# Altium project LSS_Gripper_Bottom_Board.PrjPcb (part 1 of 3)
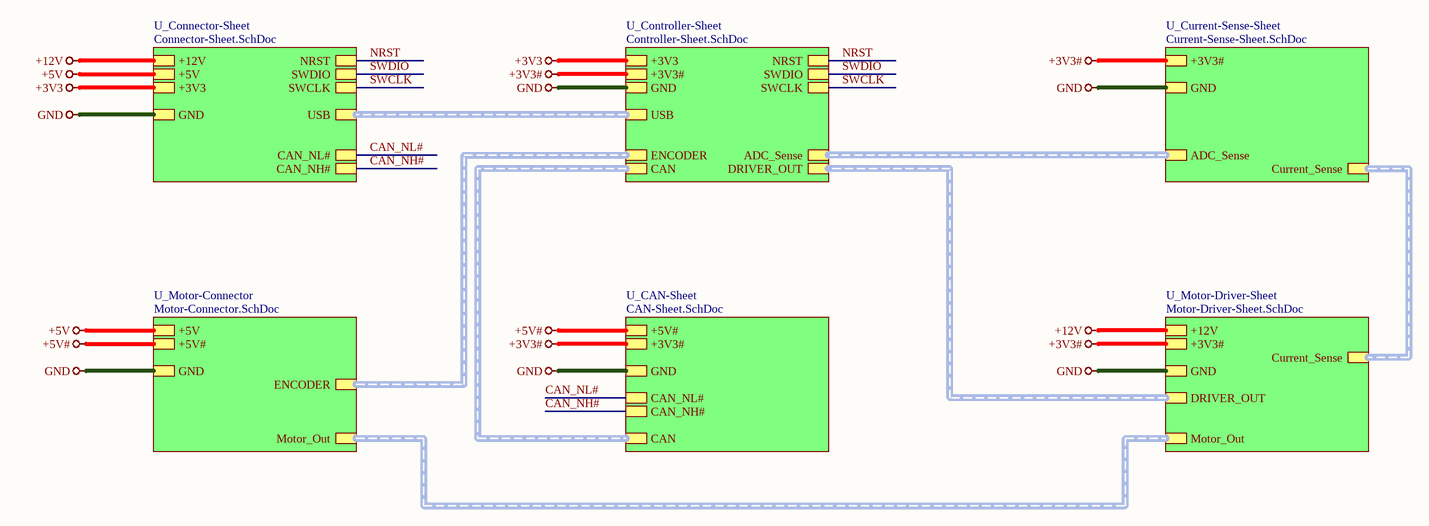
[diagram p0: Top-Sheet.SchDoc]
7 sheets, 142 parts. Net scope: hierarchical (ports join the sheet entries above them; power ports are global).
Board files: PCB1.PcbDoc, GripperBottomBoard.PcbDoc
Sheets:
  Top-Sheet.SchDoc
    U_CAN-Sheet = CAN-Sheet.SchDoc
    U_Connector-Sheet = Connector-Sheet.SchDoc
    U_Controller-Sheet = Controller-Sheet.SchDoc
    U_Current-Sense-Sheet = Current-Sense-Sheet.SchDoc
    U_Motor-Connector = Motor-Connector.SchDoc
    U_Motor-Driver-Sheet = Motor-Driver-Sheet.SchDoc

## Sheet Top-Sheet.SchDoc
size 420 x 297 mm; SheetNumber: 1; SheetTotal: 7

### Sub-sheets
U_CAN-Sheet = CAN-Sheet.SchDoc: CAN (harness CAN), +3V3#, GND, +5V#, CAN_NL#, CAN_NH#
U_Connector-Sheet = Connector-Sheet.SchDoc: USB (harness USB), +12V, +5V, +3V3, GND, CAN_NL#, CAN_NH#, SWCLK, SWDIO, NRST
U_Controller-Sheet = Controller-Sheet.SchDoc: ADC_Sense (harness ADC_Sense), ENCODER (harness ENCODER), USB (harness USB), +3V3, GND, DRIVER_OUT (harness DRIVER_OUT), CAN (harness CAN), SWCLK, SWDIO, NRST, +3V3#
U_Current-Sense-Sheet = Current-Sense-Sheet.SchDoc: Current_Sense (harness Current_Sense), ADC_Sense (harness ADC_Sense), GND, +3V3#
U_Motor-Connector = Motor-Connector.SchDoc: Motor_Out (harness Motor_Out), +5V, GND, ENCODER (harness ENCODER), +5V#
U_Motor-Driver-Sheet = Motor-Driver-Sheet.SchDoc: Current_Sense (harness Current_Sense), Motor_Out (harness Motor_Out), DRIVER_OUT (harness DRIVER_OUT), +12V, GND, +3V3#

### Nets
+3V3: sheet U_Connector-Sheet/+3V3, sheet U_Controller-Sheet/+3V3
+3V3#: sheet U_CAN-Sheet/+3V3#, sheet U_Controller-Sheet/+3V3#, sheet U_Current-Sense-Sheet/+3V3#, sheet U_Motor-Driver-Sheet/+3V3#
+5V: sheet U_Connector-Sheet/+5V, sheet U_Motor-Connector/+5V
+5V#: sheet U_CAN-Sheet/+5V#, sheet U_Motor-Connector/+5V#
+12V: sheet U_Connector-Sheet/+12V, sheet U_Motor-Driver-Sheet/+12V
GND: sheet U_CAN-Sheet/GND, sheet U_Connector-Sheet/GND, sheet U_Controller-Sheet/GND, sheet U_Current-Sense-Sheet/GND, sheet U_Motor-Connector/GND, sheet U_Motor-Driver-Sheet/GND
CAN_NH#: sheet U_CAN-Sheet/CAN_NH#, sheet U_Connector-Sheet/CAN_NH#
CAN_NL#: sheet U_CAN-Sheet/CAN_NL#, sheet U_Connector-Sheet/CAN_NL#
NRST: sheet U_Connector-Sheet/NRST, sheet U_Controller-Sheet/NRST
SWCLK: sheet U_Connector-Sheet/SWCLK, sheet U_Controller-Sheet/SWCLK
SWDIO: sheet U_Connector-Sheet/SWDIO, sheet U_Controller-Sheet/SWDIO

### Buses and harness runs
harness sheet U_CAN-Sheet/CAN = sheet U_Controller-Sheet/CAN
harness sheet U_Connector-Sheet/USB = sheet U_Controller-Sheet/USB
harness sheet U_Controller-Sheet/ADC_Sense = sheet U_Current-Sense-Sheet/ADC_Sense
harness sheet U_Controller-Sheet/DRIVER_OUT = sheet U_Motor-Driver-Sheet/DRIVER_OUT
harness sheet U_Controller-Sheet/ENCODER = sheet U_Motor-Connector/ENCODER
harness sheet U_Current-Sense-Sheet/Current_Sense = sheet U_Motor-Driver-Sheet/Current_Sense
harness sheet U_Motor-Connector/Motor_Out = sheet U_Motor-Driver-Sheet/Motor_Out

### Notes on the sheet
- File:
- Title:
- Date:
- Page
- Num:
- Total:
- Drawn By: Huzaifa Ali

## Sheet CAN-Sheet.SchDoc
size 420 x 297 mm; SheetNumber: 6; SheetTotal: 7
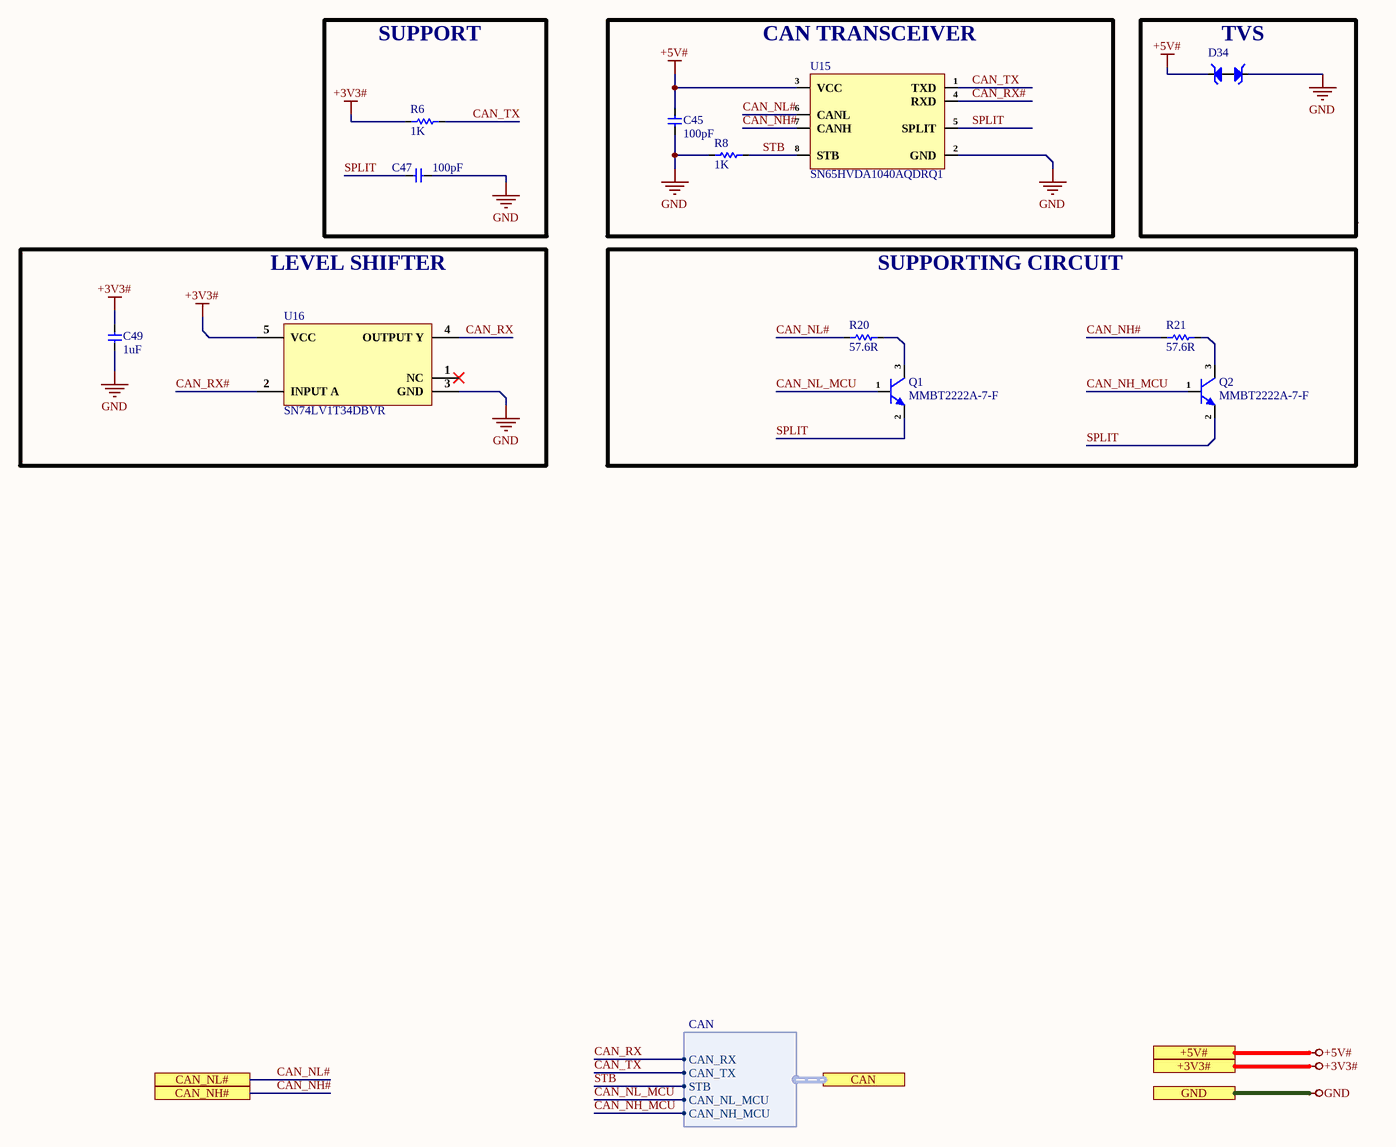
[diagram p1: CAN-Sheet.SchDoc]

### Parts
C45  100pF  [Cap-0402]
C47  100pF  [Cap-0402]
C49  1uF  [Cap-0603]
D34  PESD5V0H1BSFYL  [DSN0603-2]  (value not drawn)
Q1  MMBT2222A-7-F  [SOT-23]
Q2  MMBT2222A-7-F  [SOT-23]
R6  1K  [Res-0402]
R8  1K  [Res-0402]
R20  57.6R  [Res-0402]
R21  57.6R  [Res-0402]
U15  SN65HVDA1040AQDRQ1  [SOIC-8(0.154", 3.90mm Width)]
U16  SN74LV1T34DBVR  [SOT-23-5]

### Blocks framed on the sheet
SUPPORT: C47 R6
CAN TRANSCEIVER: C45 R8 U15
TVS: D34
LEVEL SHIFTER: C49 U16
SUPPORTING CIRCUIT: Q1 Q2 R20 R21

### Ports
+3V3# (see Top-Sheet[3B], Controller-Sheet[5D], Current-Sense-Sheet[5D]), +5V# (see Top-Sheet[3B], Motor-Connector[5D]), CAN (harness CAN, see Top-Sheet[3B], Controller-Sheet[4D]), CAN_NH# (see Top-Sheet[3B], Connector-Sheet[2D]), CAN_NL# (see Top-Sheet[3B], Connector-Sheet[2D]), GND (see Top-Sheet[3B], Connector-Sheet[5D], Controller-Sheet[5D], Current-Sense-Sheet[5D], Motor-Connector[5D], Motor-Driver-Sheet[5D])

### Harnesses
CAN: CAN_RX, CAN_TX, STB, CAN_NL_MCU, CAN_NH_MCU

### Nets
+3V3#: C49.2 R6.1 U16.5(VCC) ; port +3V3#
+5V#: C45.1 D34.2 U15.3(VCC) ; port +5V#
GND: C45.2 C47.1 C49.1 D34.1 R8.1 U15.2(GND) U16.3(GND) ; port GND
CAN_NH#: R21.1 U15.7(CANH) ; port CAN_NH#
CAN_NH_MCU: Q2.1(B) ; port CAN.CAN_NH_MCU
CAN_NL#: R20.1 U15.6(CANL) ; port CAN_NL#
CAN_NL_MCU: Q1.1(B) ; port CAN.CAN_NL_MCU
CAN_RX: U16.4(OUTPUT_Y) ; port CAN.CAN_RX
CAN_RX#: U15.4(RXD) U16.2(INPUT_A)
CAN_TX: R6.2 U15.1(TXD) ; port CAN.CAN_TX
SPLIT: C47.2 Q1.2(E) Q2.2(E) U15.5(SPLIT)
STB: R8.2 U15.8(STB) ; port CAN.STB
NetQ1_3: Q1.3(C) R20.2
NetQ2_3: Q2.3(C) R21.2

Not connected (* = marked no-connect by the designer): U16 1(NC)*

### Notes on the sheet
- File:
- Title:
- Date:
- Page
- Num:
- Total:
- Drawn By: Huzaifa Ali

### Library data of the parts
C45 C47 = CC0402JRNPO9BN101: CAP CER 100PF 50V C0G/NPO 0402; Manufacturer: Yageo; Dielectric Material: Ceramic; Tolerance: 5%; Dielectric: C0G; Temperature Coefficient: 30ppm/°C; Insulation Resistance: 100GR; Item Type: Capacitor; Supplier: Future Electronics; Supplier Part Number: 8934564; Manufacturer Part Number: CC0402JRNPO9BN101; RoHS: Yes; Category: Ceramic Capacitors; Stock: 11720000; Pricing: 10000=0.002, 40000=0.0019, 150000=0.0018, 400000=0.0018, 1000000=0.0017 (USD); Mounting Technology: Surface Mount; Case/Package: 0402; Pins: 2; Case Code (Imperial): 0402; Case Code (Metric): 1005; Min Operating Temperature: -55°C; Max Operating Temperature: 125°C; Value: 100pF; Voltage Rating: 50V; Voltage Rating (DC): 50V; Packaging: Tape and Reel; Package Quantity: 1; Termination: SMD/SMT; Voltage: 50V; Series: CC; Length: 1mm; Width: 0.02inch; Height: 0.5mm; Thickness: 0.022inch; Depth: 0.5mm; Radiation Hardening: No; RoHS Compliant: Yes; Reach SVHC Compliant: No; Lead Free: Lead Free; ComponentLink1URL: https://datasheet.ciiva.com/11786/0900766b80d84fbf-11786101.pdf?src-supplier=Rs; ComponentLink1Description: https://datasheet.ciiva.com/11786/0900766b80d84fbf-11786101.pdf?src-supplier=Rs; ComponentLink2URL: https://datasheet.ciiva.com/23767/25787-23767888.pdf?src-supplier=Newark; ComponentLink2Description: https://datasheet.ciiva.com/23767/25787-23767888.pdf?src-supplier=Newark; ComponentLink3URL: https://datasheet.ciiva.com/28450/1443161-28450220.pdf?src-supplier=Element14; ComponentLink3Description: https://datasheet.ciiva.com/28450/1443161-28450220.pdf?src-supplier=Element14; ComponentLink4URL: https://datasheet.ciiva.com/8033/1443161-8033598.pdf?src-supplier=Element14; ComponentLink4Description: https://datasheet.ciiva.com/8033/1443161-8033598.pdf?src-supplier=Element14; ComponentLink5URL: https://datasheet.ciiva.com/143/mlccorderingcode-143990.pdf?src-supplier=Digi-Key; ComponentLink5Description: https://datasheet.ciiva.com/143/mlccorderingcode-143990.pdf?src-supplier=Digi-Key; ComponentLink6URL: https://datasheet.ciiva.com/143/mlccorderingcode-143989.pdf?src-supplier=Digi-Key; ComponentLink6Description: https://datasheet.ciiva.com/143/mlccorderingcode-143989.pdf?src-supplier=Digi-Key; ComponentLink7URL: https://datasheet.ciiva.com/143/mlccorderingcode-143991.pdf?src-supplier=Digi-Key; ComponentLink7Description: https://datasheet.ciiva.com/143/mlccorderingcode-143991.pdf?src-supplier=Digi-Key; LCSC Part Number: C106200
C49 = CC0603KRX5R8BB105: CAP CER 1UF 25V X5R 0603; Manufacturer: Yageo; Tolerance: 10%; Item Type: Capacitor; Supplier 1: Digi-Key; Manufacturer Part Number: CC0603KRX5R8BB105; RoHS: Yes; Category: Ceramic Capacitors; Stock 1: 919939; Pricing 1: 1=0.12000, 10=0.08400, 50=0.04760, 100=0.03940, 500=0.02764, 1000=0.02288 (USD); Mount: Surface Mount; Case/Package: 0603; Number of Pins: 2; Case Code (Metric): 1608; Case Code (Imperial): 0603; Min Operating Temperature: -55°C; Max Operating Temperature: 85°C; Capacitance: 1uF; Dielectric: X5R; Package Quantity: 1; Voltage Rating: 25V; Packaging: Tape and Reel; Termination: SMD/SMT; Voltage Rating (DC): 25V; Series: CC; Construction: Flat; Length: 1.6mm; Width: 0.031inch; Height: 0.8mm; Thickness: 0.035inch; Depth: 0.8mm; Radiation Hardening: No; REACH SVHC: No SVHC; Lead Free: Lead Free; Halogen Free: Halogen Free; RoHS Compliant: Yes; ComponentLink1URL: https://datasheet.ciiva.com/176/mlccorderingcode-176785.pdf?src-supplier=Digi-Key; ComponentLink1Description: https://datasheet.ciiva.com/176/mlccorderingcode-176785.pdf?src-supplier=Digi-Key; ComponentLink2URL: https://datasheet.ciiva.com/176/mlccorderingcode-176786.pdf?src-supplier=Digi-Key; ComponentLink2Description: https://datasheet.ciiva.com/176/mlccorderingcode-176786.pdf?src-supplier=Digi-Key; ComponentLink3URL: https://datasheet.ciiva.com/176/mlccorderingcode-176787.pdf?src-supplier=Digi-Key; ComponentLink3Description: https://datasheet.ciiva.com/176/mlccorderingcode-176787.pdf?src-supplier=Digi-Key; ComponentLink4URL: https://datasheet.ciiva.com/17436/upy-gphc-x5r-4v-to-50v-12-17436952.pdf?src-supplier=Avnet+Europe; ComponentLink4Description: https://datasheet.ciiva.com/17436/upy-gphc-x5r-4v-to-50v-12-17436952.pdf?src-supplier=Avnet+Europe; ComponentLink5URL: https://datasheet.ciiva.com/7978/1525783-7978171.pdf?src-supplier=Element14; ComponentLink5Description: https://datasheet.ciiva.com/7978/1525783-7978171.pdf?src-supplier=Element14; ComponentLink6URL: https://datasheet.ciiva.com/11586/upy-gphc-x5r-4v-to-50v-12-11586318.pdf?src-supplier=Avnet; ComponentLink6Description: https://datasheet.ciiva.com/11586/upy-gphc-x5r-4v-to-50v-12-11586318.pdf?src-supplier=Avnet; Supplier Part Number 1: 311-1445-1-ND; LCSC Part Number: C14664
D34 = PESD5V0H1BSFYL: TVS DIODE 5VWM 6.3VC DSN0603-2; Manufacturer: Nexperia; Supplier 1: Avnet; Manufacturer Part Number: PESD5V0H1BSFYL; RoHS: Yes; Category: ESD and Circuit Protection ICs; Stock 1: 9000; Pricing 1: 18000=0.06453, 36000=0.06278, 54000=0.06104, 90000=0.05930, 180000=0.05755, 900000=0.05581, 1800000=0.05406 (USD); RoHS Compliant: Yes; ComponentLink1URL: http://www.farnell.com/datasheets/1961312.pdf?src-supplier=Farnell; ComponentLink1Description: http://www.farnell.com/datasheets/1961312.pdf?src-supplier=Farnell; ComponentLink2URL: https://assets.nexperia.com/documents/data-sheet/PESD5V0H1BSF.pdf?src-supplier=Digi-Key; ComponentLink2Description: https://assets.nexperia.com/documents/data-sheet/PESD5V0H1BSF.pdf?src-supplier=Digi-Key; ComponentLink3URL: http://www.farnell.com/datasheets/1961312.pdf?src-supplier=Newark; ComponentLink3Description: http://www.farnell.com/datasheets/1961312.pdf?src-supplier=Newark; Supplier Part Number 1: PESD5V0H1BSFYL; LCSC Part Number: C477989; Item Type: Diode
Q1 Q2 = MMBT2222A-7-F: TRANS NPN 40V 0.6A SMD SOT23-3; Manufacturer: Diodes; Max Power Dissipation: 300mW; Collector Base Voltage (VCBO): 75V; Max Collector Current: 600mA; hFE Min: 100; Frequency: 300MHz; Number of Elements: 1; Emitter Base Voltage (VEBO): 6V; Collector Emitter Saturation Voltage: 1V; Power Dissipation: 350mW; Element Configuration: Single; Current: 1A; Item Type: Mosfet; Supplier 1: Digi-Key; Manufacturer Part Number: MMBT2222A-7-F; Stock 1: 2471182; Pricing 1: 1=0.15, 10=0.134, 100=0.0729, 500=0.04486, 1000=0.03059 (USD); Mount: Surface Mount; Case/Package: SOT-23; Number of Pins: 3; Weight: 0.000282oz; Contact Plating: Matte,Tin; Min Operating Temperature: -55°C; Max Operating Temperature: 150°C; Packaging: Tape and Reel; Collector Emitter Voltage (VCEO): 40V; Polarity: NPN; Voltage Rating (DC): 40V; Package Quantity: 3000; Continuous Collector Current: 600mA; Collector Emitter Breakdown Voltage: 40V; Transition Frequency: 300MHz; Max Breakdown Voltage: 40V; Max Frequency: 300MHz; Termination: SMD/SMT; Gain Bandwidth Product: 300MHz; Current Rating: 600mA; Voltage: 40V; Length: 3.05mm; Height: 1mm; Width: 1.4mm; Radiation Hardening: No; Lead Free: Lead Free; REACH SVHC: No SVHC; ComponentLink1URL: http://www.diodes.com/datasheets/ds30041.pdf?src-supplier=Future+Electronics; ComponentLink1Description: http://www.diodes.com/datasheets/ds30041.pdf?src-supplier=Future+Electronics; ComponentLink2URL: http://www.diodes.com/datasheets/ds30041.pdf?src-supplier=Avnet; ComponentLink2Description: http://www.diodes.com/datasheets/ds30041.pdf?src-supplier=Avnet; ComponentLink3URL: https://www.verical.com/server-webapp/html/getDatasheet?partID=82692&src-supplier=Verical; ComponentLink3Description: https://www.verical.com/server-webapp/html/getDatasheet?partID=82692&src-supplier=Verical; ComponentLink4URL: https://www.diodes.com/assets/Datasheets/ds30041.pdf?src-supplier=Digi-Key; ComponentLink4Description: https://www.diodes.com/assets/Datasheets/ds30041.pdf?src-supplier=Digi-Key; ComponentLink5URL: http://www.diodes.com/datasheets/ds30041.pdf?src-supplier=Avnet+Europe; ComponentLink5Description: http://www.diodes.com/datasheets/ds30041.pdf?src-supplier=Avnet+Europe; ComponentLink6URL: http://www.diodes.com/datasheets/ds30041.pdf?src-supplier=Element14; ComponentLink6Description: http://www.diodes.com/datasheets/ds30041.pdf?src-supplier=Element14; Supplier Part Number 1: MMBT2222A-FDIDKR-ND; LCSC Part Number: C94515
R6 = RC0402FR-071KL: RES 1K OHM 1% 1/16W 0402; Manufacturer: Yageo; Resistance: 1kR; Temperature Coefficient: 100ppm/°C; Voltage Rating (DC): 50V; Power Rating: 62.5mW; Max Power Dissipation: 63mW; Item Type: Resistor; Supplier 1: Avnet; Manufacturer Part Number: RC0402FR-071KL; RoHS: Yes; Category: Chip SMD Resistors; Stock 1: 13030000; Pricing 1: 10000=0.00085, 20000=0.00087, 40000=0.00084, 60000=0.00083, 80000=0.00079, 100000=0.00078, 1000000=0.00076 (USD); Case/Package: 0402; Number of Pins: 2; Case Code (Imperial): 0402; Case Code (Metric): 1005; Size Code: 0402; Min Operating Temperature: -55°C; Max Operating Temperature: 155°C; Resistor Type: Thick Film; Tolerance: 1%; Packaging: Tape and Reel; Voltage Rating: 50V; Termination: SMD/SMT; Features: Moisture Resistant; Series: RC; Number of Terminations: 2; Resistance Tolerance: 1%; Construction: Rectangular; Technology: THICK FILM; Length: 1mm; Width: 0.5mm; Height: 0.32mm; Depth: 0.5mm; Reach SVHC Compliant: Yes; Lead Free: Lead Free; RoHS Compliant: Yes; Military Standard: Not; ComponentLink1URL: https://datasheet.ciiva.com/11819/0900766b80c66297-11819477.pdf?src-supplier=RSComponents; ComponentLink1Description: https://datasheet.ciiva.com/11819/0900766b80c66297-11819477.pdf?src-supplier=RSComponents; ComponentLink2URL: https://datasheet.ciiva.com/7983/1018594-7983502.pdf?src-supplier=Element14; ComponentLink2Description: https://datasheet.ciiva.com/7983/1018594-7983502.pdf?src-supplier=Element14; ComponentLink3URL: https://datasheet.ciiva.com/22747/1018594-22747513.pdf?src-supplier=Element14; ComponentLink3Description: https://datasheet.ciiva.com/22747/1018594-22747513.pdf?src-supplier=Element14; ComponentLink4URL: https://datasheet.ciiva.com/12666/pyu-rc0402-51-rohs-l-6-r-12666741.pdf?src-supplier=Mouser; ComponentLink4Description: https://datasheet.ciiva.com/12666/pyu-rc0402-51-rohs-l-6-r-12666741.pdf?src-supplier=Mouser; ComponentLink5URL: https://datasheet.ciiva.com/7849/1018594-7849869.pdf?src-supplier=Element14; ComponentLink5Description: https://datasheet.ciiva.com/7849/1018594-7849869.pdf?src-supplier=Element14; ComponentLink6URL: https://datasheet.ciiva.com/7849/1018594-7849871.pdf?src-supplier=Element14; ComponentLink6Description: https://datasheet.ciiva.com/7849/1018594-7849871.pdf?src-supplier=Element14; ComponentLink7URL: https://datasheet.ciiva.com/17063/pyu-rc0402-51-rohs-l-6-r-17063193.pdf?src-supplier=Future+Electronics; ComponentLink7Description: https://datasheet.ciiva.com/17063/pyu-rc0402-51-rohs-l-6-r-17063193.pdf?src-supplier=Future+Electronics; Supplier Part Number 1: RC0402FR-071KL; LCSC Part Number: C106235
R8 = CRCW04021K00FKEDHP: RES SMD 1K OHM 1% 1/5W 0402; Manufacturer: Vishay Dale; Resistance: 1kR; Temperature Coefficient: 100ppm/°C; Power Rating: 125mW; Voltage Rating: 50V; Supplier 1: Digi-Key; Manufacturer Part Number: CRCW04021K00FKEDHP; Stock 1: 315989; Pricing 1: 1=0.15, 10=0.132, 100=0.0506, 1000=0.02226, 2500=0.01923, 5000=0.0172 (USD); Mount: Surface Mount; Case/Package: 0402; Number of Pins: 2; Contact Plating: Tin; Weight: 2.3E-05oz; Case Code (Imperial): 0402; Case Code (Metric): 1005; Size Code: 0402; Min Operating Temperature: -55°C; Max Operating Temperature: 155°C; Tolerance: 1%; Resistor Type: Thick Film; Package Quantity: 10; Packaging: Tape and Reel; Number of Terminations: 2; Termination: SMD/SMT; Max Power Dissipation: 125mW; Voltage Rating (DC): 50V; Features: Automotive AEC-Q200; Series: CRCW-HP; Construction: Rectangular; Technology: THICK FILM; Resistance Tolerance: 1%; Length: 1mm; Width: 0.5mm; Height: 0.3mm; Depth: 0.5mm; Radiation Hardening: No; REACH SVHC: Unknown; Military Standard: Not; Lead Free: Lead Free; RoHS Compliant: Yes; ComponentLink1URL: http://www.farnell.com/datasheets/2339608.pdf?src-supplier=Element14; ComponentLink1Description: http://www.farnell.com/datasheets/2339608.pdf?src-supplier=Element14; ComponentLink2URL: http://www.vishay.com/docs/20043/crcwhpe3.pdf?src-supplier=Digi-Key; ComponentLink2Description: http://www.vishay.com/docs/20043/crcwhpe3.pdf?src-supplier=Digi-Key; ComponentLink3URL: http://www.mouser.com/ds/2/427/crcwhpe3-46056.pdf?src-supplier=Mouser; ComponentLink3Description: http://www.mouser.com/ds/2/427/crcwhpe3-46056.pdf?src-supplier=Mouser; ComponentLink4URL: http://www.vishay.com/docs/20043/crcwhpe3.pdf?src-supplier=Avnet; ComponentLink4Description: http://www.vishay.com/docs/20043/crcwhpe3.pdf?src-supplier=Avnet; ComponentLink5URL: http://www.vishay.com/docs/20043/crcwhpe3.pdf?src-supplier=Future+Electronics; ComponentLink5Description: http://www.vishay.com/docs/20043/crcwhpe3.pdf?src-supplier=Future+Electronics; Supplier Part Number 1: 541-1.00KYCT-ND; LCSC Part Number: C313354
R20 R21 = ERJ-2RKF57R6X: RES SMD 57.6 OHM 1% 1/10W 0402; Manufacturer: Panasonic; Item Type: Resistors; Supplier: Mouser; Supplier Part Number: 667-ERJ-2RKF57R6X; Manufacturer Part Number: ERJ-2RKF57R6X; RoHS: Yes; Stock: 32931; Pricing: 1=0.1, 10=0.015, 50=0.015, 100=0.009, 1000=0.006, 10000=0.003 (USD); ComponentLink1URL: https://datasheet.ciiva.com/9188/aoa0000ce2-9188571.pdf?src-supplier=Avnet; ComponentLink1Description: https://datasheet.ciiva.com/9188/aoa0000ce2-9188571.pdf?src-supplier=Avnet; ComponentLink2URL: https://datasheet.ciiva.com/9188/aoa0000ce2-9188574.pdf?src-supplier=Avnet; ComponentLink2Description: https://datasheet.ciiva.com/9188/aoa0000ce2-9188574.pdf?src-supplier=Avnet; ComponentLink3URL: https://datasheet.ciiva.com/24026/aoa0000ce2-24026248.pdf?src-supplier=Mouser; ComponentLink3Description: https://datasheet.ciiva.com/24026/aoa0000ce2-24026248.pdf?src-supplier=Mouser; ComponentLink4URL: https://datasheet.ciiva.com/43467/1678782-43467198.pdf?src-supplier=Farnell; ComponentLink4Description: https://datasheet.ciiva.com/43467/1678782-43467198.pdf?src-supplier=Farnell; ComponentLink5URL: https://datasheet.ciiva.com/46372/1678782-46372935.pdf?src-supplier=Element14; ComponentLink5Description: https://datasheet.ciiva.com/46372/1678782-46372935.pdf?src-supplier=Element14; ComponentLink6URL: https://datasheet.ciiva.com/46372/1678782-46372936.pdf?src-supplier=Element14; ComponentLink6Description: https://datasheet.ciiva.com/46372/1678782-46372936.pdf?src-supplier=Element14; ComponentLink7URL: https://datasheet.ciiva.com/22668/1678782-22668391.pdf?src-supplier=Element14; ComponentLink7Description: https://datasheet.ciiva.com/22668/1678782-22668391.pdf?src-supplier=Element14; ComponentLink8URL: https://datasheet.ciiva.com/22743/1678782-22743894.pdf?src-supplier=Element14; ComponentLink8Description: https://datasheet.ciiva.com/22743/1678782-22743894.pdf?src-supplier=Element14; ComponentLink9URL: https://datasheet.ciiva.com/30107/aoa0000ce2-30107676.pdf?src-supplier=Onlinecomponents.com; ComponentLink9Description: https://datasheet.ciiva.com/30107/aoa0000ce2-30107676.pdf?src-supplier=Onlinecomponents.com; LCSC Part Number: C3025671
U15 = SN65HVDA1040AQDRQ1: IC TRANSCEIVER HALF 1/1 8SOIC; Manufacturer: Texas Instruments; Supplier: Mouser; LCSC Part Number: C188675; Manufacturer Part Number: SN65HVDA1040AQDRQ1; RoHS: Yes; Item Type: IC; Stock: 5009; Pricing: 1=2.2, 10=1.87, 50=1.87, 100=1.59, 1000=1.08, 10000=0.971 (USD); ComponentLink1URL: https://datasheet.ciiva.com/28652/1787993-28652354.pdf?src-supplier=Element14; ComponentLink1Description: https://datasheet.ciiva.com/28652/1787993-28652354.pdf?src-supplier=Element14; ComponentLink2URL: https://datasheet.ciiva.com/41461/001187135-da-01-en-ic-transcv-sn65hvda1040aqdrq1-soic-8-tid-41461891.pdf?src-supplier=Conrad; ComponentLink2Description: https://datasheet.ciiva.com/41461/001187135-da-01-en-ic-transcv-sn65hvda1040aqdrq1-soic-8-tid-41461891.pdf?src-supplier=Conrad; ComponentLink3URL: https://datasheet.ciiva.com/15150/getdatasheetpartid-184324-15150727.pdf?src-supplier=Verical; ComponentLink3Description: https://datasheet.ciiva.com/15150/getdatasheetpartid-184324-15150727.pdf?src-supplier=Verical; ComponentLink4URL: https://datasheet.ciiva.com/1766/sn65hvda1040a-q1-1766438.pdf?src-supplier=Digikey; ComponentLink4Description: https://datasheet.ciiva.com/1766/sn65hvda1040a-q1-1766438.pdf?src-supplier=Digikey; ComponentLink5URL: https://datasheet.ciiva.com/1766/sn65hvda1040a-q1-1766439.pdf?src-supplier=Digikey; ComponentLink5Description: https://datasheet.ciiva.com/1766/sn65hvda1040a-q1-1766439.pdf?src-supplier=Digikey; ComponentLink6URL: https://datasheet.ciiva.com/1766/sn65hvda1040a-q1-1766440.pdf?src-supplier=Digikey; ComponentLink6Description: https://datasheet.ciiva.com/1766/sn65hvda1040a-q1-1766440.pdf?src-supplier=Digikey
U16 = SN74LV1T34DBVR: IC BUF NON-INVERT 5.5V SOT23-5; Manufacturer: Texas Instruments; Number of Elements: 1; Logic Function: Buffer,Inverting; High Level Output Current: -8mA; Low Level Output Current: 8mA; Min Supply Voltage: 1.6V; Polarity: Non-Inverting; Propagation Delay: 15.5ns; Quiescent Current: 1uA; Supplier 1: Digi-Key; Manufacturer Part Number: SN74LV1T34DBVR; Stock 1: 37360; Pricing 1: 1=0.43, 10=0.349, 25=0.3192, 100=0.2374, 250=0.2152, 500=0.17808, 1000=0.13356 (USD); Mount: Surface Mount; Case/Package: SOT-23-5; Number of Pins: 5; Weight: 0.000353oz; Min Operating Temperature: -40°C; Max Operating Temperature: 125°C; Packaging: Tape and Reel; Number of Bits per Element: 1; Number of Bits: 1; Package Quantity: 3000; Max Supply Voltage: 5.5V; Number of Input Lines: 1; Number of Output Lines: 1; Operating Supply Current: 8mA; Number of Channels: 1; Number of Inputs: 1; Number of Outputs: 1; Radiation Hardening: No; RoHS Compliant: Yes; REACH SVHC: No SVHC; Lead Free: Lead Free; ComponentLink1URL: http://www.ti.com/lit/pdf/sdyu001?src-supplier=Digi-Key; ComponentLink1Description: http://www.ti.com/lit/pdf/sdyu001?src-supplier=Digi-Key; ComponentLink2URL: http://www.ti.com/lit/ds/symlink/sn74lv1t34.pdf?src-supplier=Avnet; ComponentLink2Description: http://www.ti.com/lit/ds/symlink/sn74lv1t34.pdf?src-supplier=Avnet; Supplier Part Number 1: 296-37176-6-ND; LCSC Part Number: C100024; Item Type: IC

## Sheet Connector-Sheet.SchDoc
size 420 x 297 mm; SheetNumber: 7; SheetTotal: 7
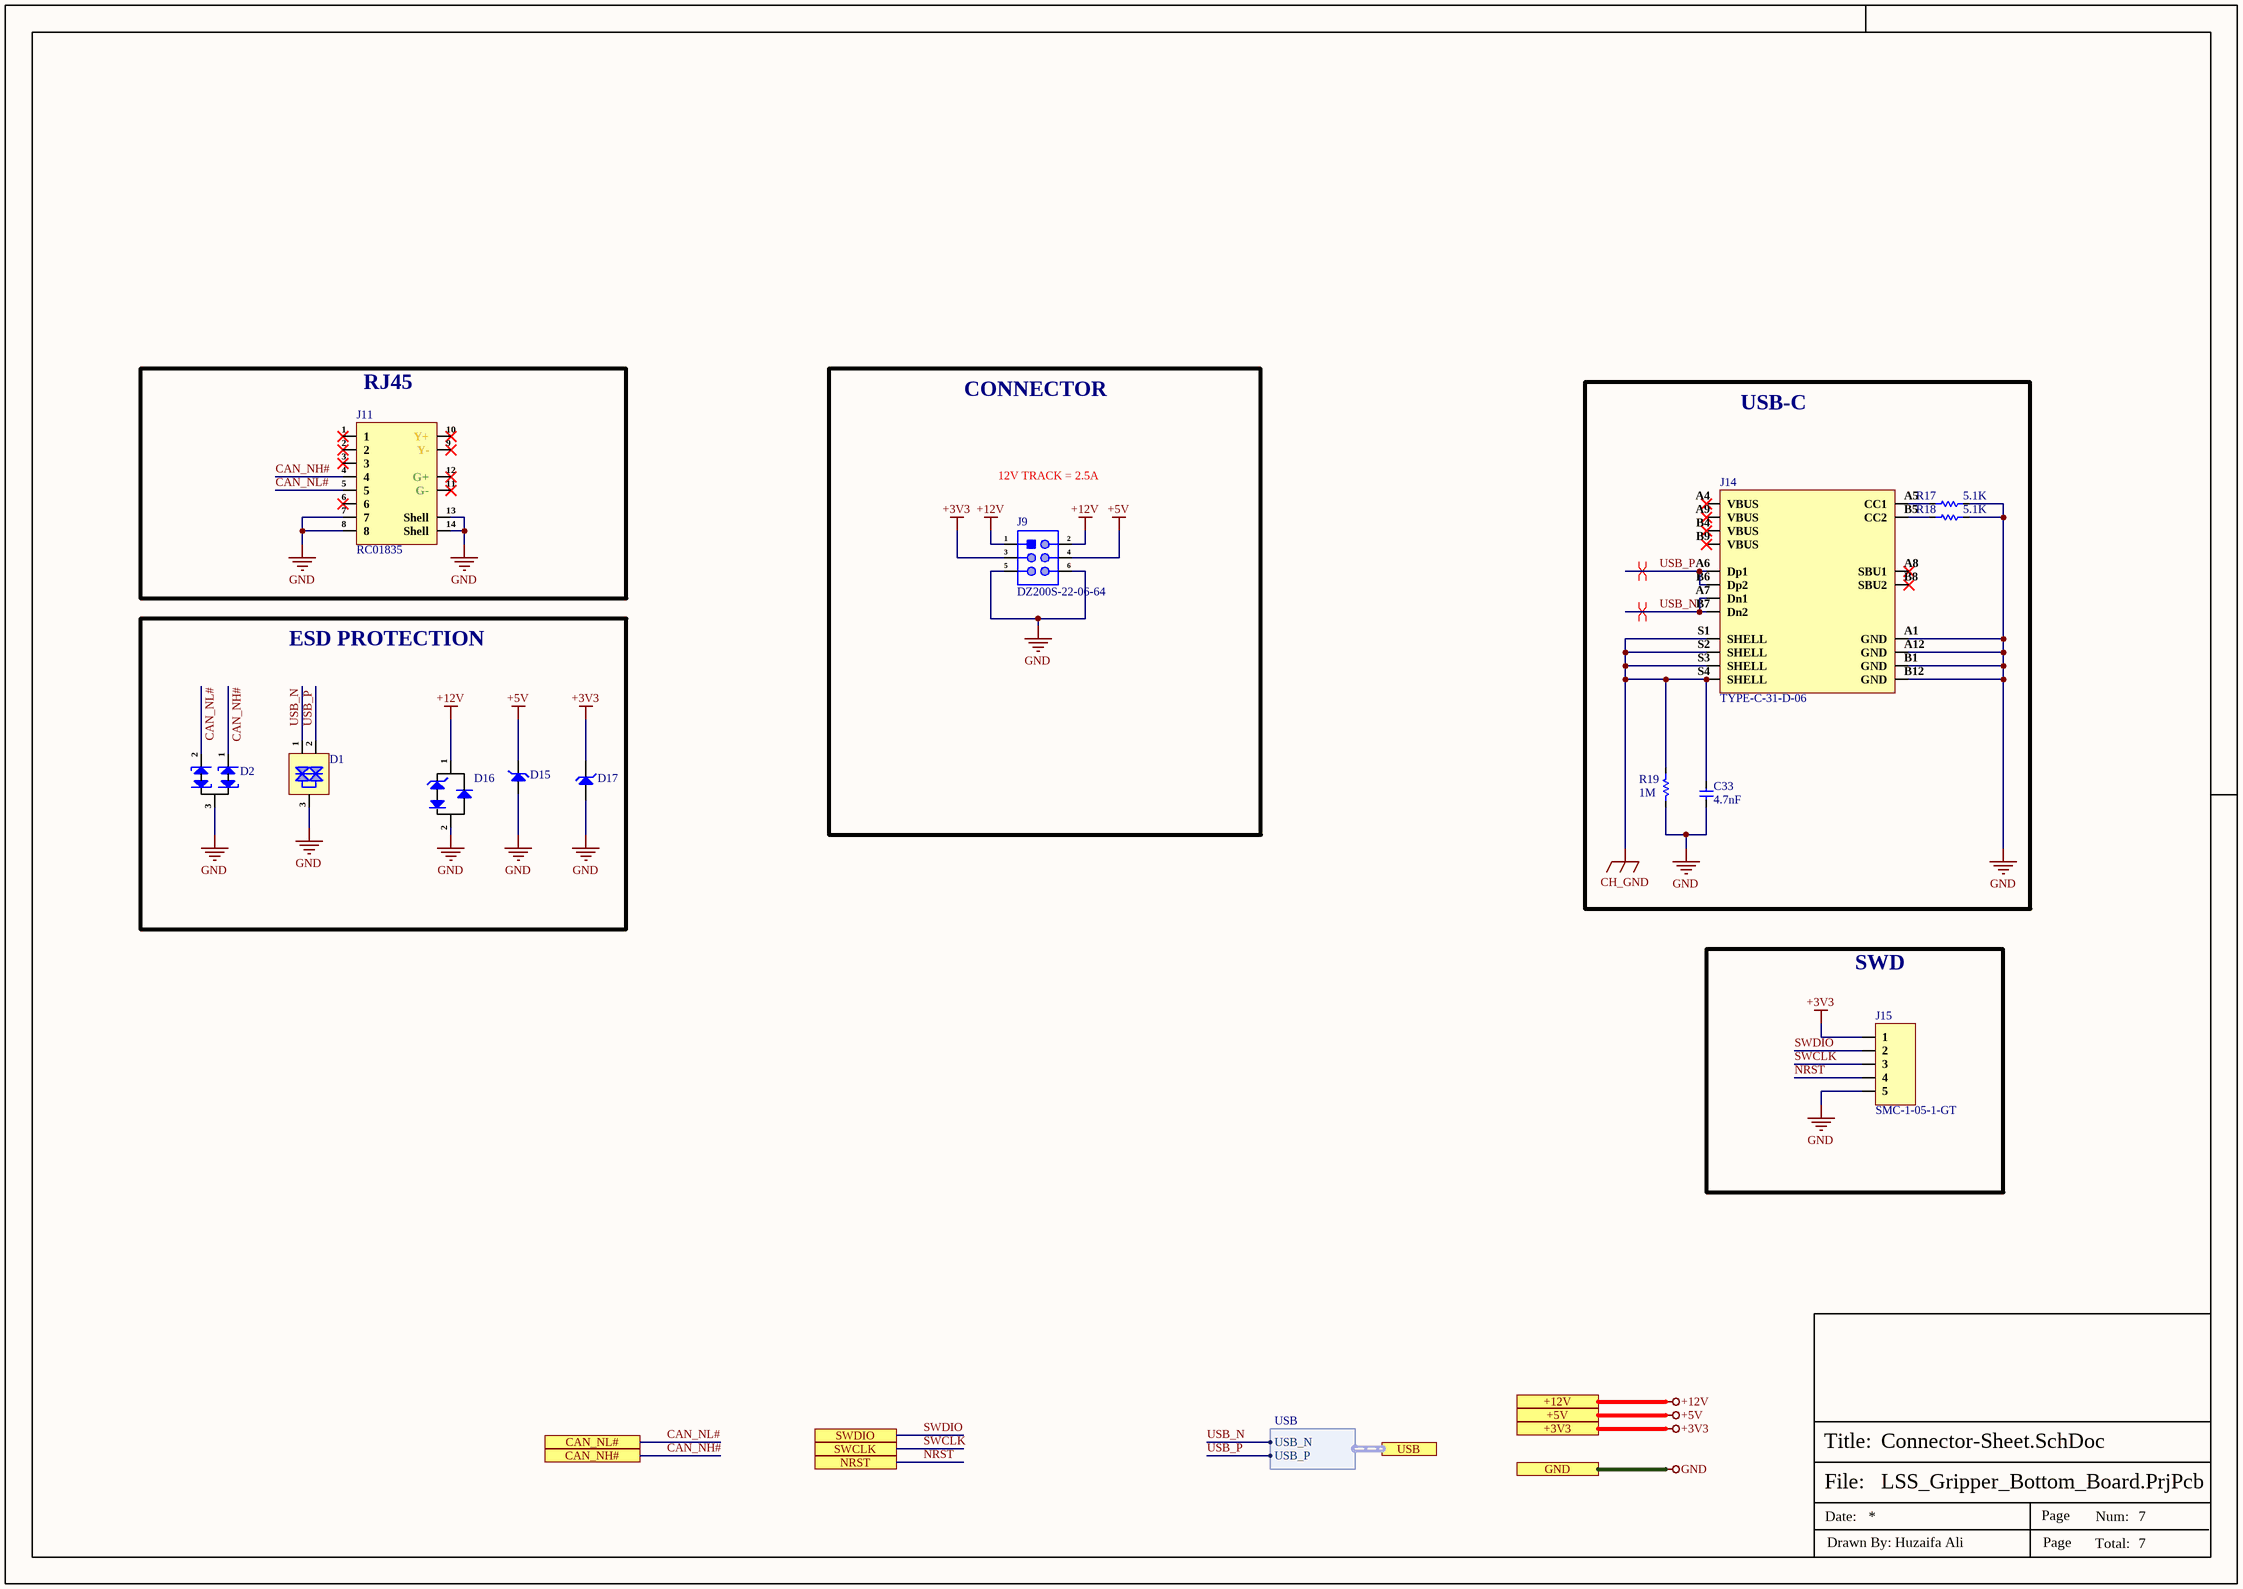
[diagram p2: Connector-Sheet.SchDoc]

### Parts
C33  4.7nF  [Cap-1206]
D1  ESD5302F-3/TR  [Sot-23]  (value not drawn)
D2  PESD2CAN,215  [SOT-23]  (value not drawn)
D15  P6SMB6.8A  [SMB_]  (value not drawn)
D16  SD12LC  [SOD-323]  (value not drawn)
D17  AZ3003-01G  [SOD-123]  (value not drawn)
J9  DZ200S-22-06-64  [HDR 2x3 Male SMD(2mm Pitch)]
J11  RC01835  [RC01835]
J14  TYPE-C-31-D-06  [TYPE-C-31-D-06]
J15  SMC-1-05-1-GT  [SMC-1-05-1-GT]
R17  5.1K  [Res-0402]
R18  5.1K  [Res-0402]
R19  1M  [Res-0603]

### Blocks framed on the sheet
RJ45: J11
CONNECTOR: J9
USB-C: C33 J14 R17-R19
ESD PROTECTION: D1 D2 D15-D17
SWD: J15

### Ports
+3V3 (see Top-Sheet[2B], CAN-Sheet[5D], Controller-Sheet[5D], Current-Sense-Sheet[5D], Motor-Driver-Sheet[5D]), +5V (see Top-Sheet[2A], CAN-Sheet[5D], Motor-Connector[5D]), +12V (see Top-Sheet[2A], Motor-Driver-Sheet[5D]), CAN_NH# (see Top-Sheet[2B], CAN-Sheet[2D]), CAN_NL# (see Top-Sheet[2B], CAN-Sheet[2D]), GND (see Top-Sheet[2B], CAN-Sheet[5D], Controller-Sheet[5D], Current-Sense-Sheet[5D], Motor-Connector[5D], Motor-Driver-Sheet[5D]), NRST (see Top-Sheet[2A], Controller-Sheet[5D]), SWCLK (see Top-Sheet[2B], Controller-Sheet[5D]), SWDIO (see Top-Sheet[2A], Controller-Sheet[5D]), USB (harness USB, see Top-Sheet[2B], Controller-Sheet[4D])

### Harnesses
USB: USB_N, USB_P

### Nets
+3V3: D17.2(K) J9.3 J15.1 ; port +3V3
+5V: D15.2(C) J9.4 ; port +5V
+12V: D16.1(K) J9.1 J9.2 ; port +12V
CH_GND: C33.1 J14.S1(SHELL) J14.S2(SHELL) J14.S3(SHELL) J14.S4(SHELL) R19.1
GND: C33.2 D1.3(GND) D2.3(C_K) D15.1(A) D16.2(A/K) D17.1(A) J9.5 J9.6 J11.7 J11.8 J11.13(Shell) J11.14(Shell) J14.A1(GND) J14.A12(GND) J14.B1(GND) J14.B12(GND) J15.5 R17.2 R18.2 R19.2 ; port GND
CAN_NH#: D2.1(K1) J11.4 ; port CAN_NH#
CAN_NL#: D2.2(K2) J11.5 ; port CAN_NL#
NRST: J15.4 ; port NRST
SWCLK: J15.3 ; port SWCLK
SWDIO: J15.2 ; port SWDIO
USB_N: D1.1(I/O1) J14.A7(Dn1) J14.B7(Dn2) ; port USB.USB_N
USB_P: D1.2(I/O2) J14.A6(Dp1) J14.B6(Dp2) ; port USB.USB_P
NetJ14_A5: J14.A5(CC1) R17.1
NetJ14_B5: J14.B5(CC2) R18.1

Not connected (* = marked no-connect by the designer): J11 1* 2* 3* 6* 9(Y-)* 10(Y+)* 11(G-)* 12(G+)*; J14 A4(VBUS)* A8(SBU1)* A9(VBUS)* B4(VBUS)* B8(SBU2)* B9(VBUS)*

### Layout directives
differential pair; net class USB; differential pair class USB_Lines; rule Impedance Constraint [Min = 88.00    Max = 90.00    ]; rule Matched Net Lengths [Tolerance = 20mil]: USB_N, USB_P

### Notes on the sheet
- 12V TRACK = 2.5A
- File:
- Title:
- Date:
- Page
- Num:
- Total:
- Drawn By: Huzaifa Ali

### Library data of the parts
C33 = CC1206KKX7RCBB472: CAP CER 4700PF 1KV X7R 1206; Manufacturer: Yageo; Dielectric Material: Ceramic; Tolerance: 10%; Item Type: Capacitor; Supplier 1: Future Electronics; Manufacturer Part Number: CC1206KKX7RCBB472; RoHS: Yes; Category: Ceramic Capacitors; Stock 1: 180000; Pricing 1: 3000=0.02860, 9000=0.02750, 15000=0.02700, 45000=0.02600, 75000=0.02510 (USD); Mount: Surface Mount; Case/Package: 1206; Number of Pins: 2; Case Code (Imperial): 1206; Case Code (Metric): 3216; Weight: 0.000571oz; Min Operating Temperature: -55°C; Max Operating Temperature: 125°C; Voltage Rating: 1kV; Capacitance: 4.7nF; Packaging: Tape and Reel; Voltage Rating (DC): 1kV; Dielectric: X7R; Termination: SMD/SMT; Resistor Type: Ceramic; Series: CC; Length: 3.2mm; Width: 0.063inch; Thickness: 0.057inch; Depth: 1.6mm; Radiation Hardening: No; Lead Free: Lead Free; RoHS Compliant: Yes; ComponentLink1URL: https://datasheet.ciiva.com/13208/upy-gp-np0-16v-to-50v-8-13208693.pdf?src-supplier=Mouser; ComponentLink1Description: https://datasheet.ciiva.com/13208/upy-gp-np0-16v-to-50v-8-13208693.pdf?src-supplier=Mouser; ComponentLink2URL: https://datasheet.ciiva.com/11466/hv-11466701.pdf?src-supplier=Avnet; ComponentLink2Description: https://datasheet.ciiva.com/11466/hv-11466701.pdf?src-supplier=Avnet; Supplier Part Number 1: 7130131; LCSC Part Number: C107198
D1 = ESD5302F-3/TR: 16A 20V 7V 5V@Max Unidirectional SOT-23 TVS ROHS; Manufacturer: WILLSEMI; Item Type: Diode; Manufacturer Part Number: ESD5302F-3/TR; Package: SOT-23; LCSC Part Number: C239643; ComponentLink1Description: LCSC; ComponentLink1URL: https://www.lcsc.com/product-detail/TVS_WILLSEMI-Will-Semicon-ESD5302F-3-TR_C239643.html
D2 = PESD2CAN,215: TVS DIODE 24VWM 41VC TO236AB; Manufacturer: Nexperia; Supplier 1: Arrow Electronics; Manufacturer Part Number: PESD2CAN,215; RoHS: No; Category: ESD and Circuit Protection ICs; Stock 1: 775; Pricing 1: 1=0.48690, 10=0.40120, 25=0.38650, 50=0.33780, 100=0.25440, 250=0.25380, 500=0.25120 (USD); ComponentLink1URL: http://www.farnell.com/datasheets/1750978.pdf?src-supplier=Farnell; ComponentLink1Description: http://www.farnell.com/datasheets/1750978.pdf?src-supplier=Farnell; ComponentLink2URL: https://assets.nexperia.com/documents/data-sheet/PESD2CAN.pdf?src-supplier=Digi-Key; ComponentLink2Description: https://assets.nexperia.com/documents/data-sheet/PESD2CAN.pdf?src-supplier=Digi-Key; ComponentLink3URL: http://www.farnell.com/datasheets/1750978.pdf?src-supplier=Newark; ComponentLink3Description: http://www.farnell.com/datasheets/1750978.pdf?src-supplier=Newark; Supplier Part Number 1: PESD2CAN,215; LCSC Part Number: C75176
D15 = P6SMB6.8A: 58.1A 600W 10.5V@58.1A 6.45V Unidirectional 5.8V SMB Electrostatic and Surge Protection (TVS/ESD) ROHS; Manufacturer: BORN; Manufacturer Part Number: P6SMB6.8A; Package: SMB; LCSC Part Number: C5439947; Item Type: TVS/ESD; ComponentLink1Description: LCSC; ComponentLink1URL: https://www.lcsc.com/product-detail/Electrostatic-and-Surge-Protection-TVS-ESD_BORN-P6SMB6-8A_C5439947.html
D16 = SD12LC: TVS DIODE 12VWM 28.6VC SOD323; Manufacturer: Sangdest Microelectronics; Supplier: DigiKey; Supplier Part Number: 1655-SD12LCCT-ND; Manufacturer Part Number: SD12LC; Stock: 575; Pricing: 1=0.43, 10=0.305, 100=0.1541, 500=0.13654, 1000=0.10625 (USD); Item Type: Diode
D17 = AZ3003-01G: TVS SURGE PROTECTOR 1-CH 3.3V; Manufacturer: Amazing; Item Type: Diode; Manufacturer Part Number: AZ3003-01G; Package: SOD-123; LCSC Part Number: -; ComponentLink1Description: Digikey; ComponentLink1URL: https://www.digikey.com/en/products/detail/amazing/AZ3003-01G/16615352?s=N4IgTCBcDaIIIC0DMAGFSC0KCMBxEAugL5A
J9 = DZ200S-22-06-64: Brick nogging Square Pins 6P 2mm 双排 2x3P SMD,P=2mm Pin Headers ROHS; Manufacturer: DEALON; Item Type: Connector; Manufacturer Part Number: DZ200S-22-06-64; LCSC Part Number: C5160768; Package: SMD,P=2mm; ComponentLink1Description: LCSC Link; ComponentLink1URL: https://www.lcsc.com/product-detail/Pin-Headers_DEALON-DZ200S-22-06-64_C5160768.html
J11 = RC01835: RJ45 RJReceptacle 1 有屏蔽 Sink board WithLED -40℃~+70℃ Plugin Ethernet Connectors/Modular Connectors (RJ45 RJ11) ROHS; Manufacturer: RCH; Manufacturer Part Number: RC01835; Package: Plugin; LCSC Part Number: C708648; Item Type: Ethernet; ComponentLink1Description: LCSC; ComponentLink1URL: https://www.lcsc.com/product-detail/Ethernet-Connectors-Modular-Connectors-RJ45-RJ11_RCH-RC01835_C708648.html
J14 = TYPE-C-31-D-06: 1 Brick nogging 16 Female -25℃~+85℃ Type-C SMD USB Connectors ROHS; Manufacturer: Korean Hroparts Elec; Manufacturer Part Number: TYPE-C-31-D-06; Package: Custom; LCSC Part Number: C2689964; Item Type: USB Connector; ComponentLink1Description: LCSC; ComponentLink1URL: https://www.lcsc.com/product-detail/USB-Connectors_Korean-Hroparts-Elec-TYPE-C-31-D-06_C2689964.html
J15 = SMC-1-05-1-GT: MACHINE PIN SOCKET 5P 2.54MM PIT; Manufacturer: Adam Equipment; Item Type: Pin Header; Supplier 1: Digi-Key; Manufacturer Part Number: SMC-1-05-1-GT; RoHS: No; Stock 1: 1697; Pricing 1: 1=0.41000, 10=0.38500, 25=0.33040, 50=0.28080, 100=0.26970, 250=0.24224, 500=0.23120, 1000=0.19268, 2500=0.17616 (USD); Supplier Part Number 1: 2057-SMC-1-05-1-GT-ND; LCSC Part Number: C3320109
R17 R18 = RC0402FR-075K1L: RES 5.1K OHM 1% 1/16W 0402; Manufacturer: Yageo; Power Rating: 63mW; Resistance: 5.1kR; Temperature Coefficient: 100ppm/°C; Voltage Rating: 50V; Item Type: Resistor; Supplier 1: Avnet; Manufacturer Part Number: RC0402FR-075K1L; RoHS: Yes; Category: Chip SMD Resistors; Stock 1: 65000; Pricing 1: 10000=0.00085 (USD); Case/Package: 0402; Case Code (Metric): 1005; Case Code (Imperial): 0402; Min Operating Temperature: -55°C; Max Operating Temperature: 155°C; Tolerance: 1%; Technology: THICK FILM; Packaging: Tape and Reel; Package Quantity: 1; Resistor Type: Thick Film; Number of Terminations: 2; Termination: SMD/SMT; Max Power Dissipation: 63mW; Voltage Rating (DC): 50V; Working Voltage: 50V; Features: Moisture Resistant; Series: RC; Resistance Tolerance: 1%; Construction: Rectangular; Length: 1mm; Width: 0.02inch; Height: 0.016inch; Depth: 0.5mm; RoHS Compliant: Yes; Military Standard: Not; Lead Free: Lead Free; ComponentLink1URL: https://datasheet.ciiva.com/7983/1018594-7983519.pdf?src-supplier=Element14; ComponentLink1Description: https://datasheet.ciiva.com/7983/1018594-7983519.pdf?src-supplier=Element14; ComponentLink2URL: https://datasheet.ciiva.com/46394/1018594-46394936.pdf?src-supplier=Element14; ComponentLink2Description: https://datasheet.ciiva.com/46394/1018594-46394936.pdf?src-supplier=Element14; ComponentLink3URL: https://datasheet.ciiva.com/2453/pyu-r-int-thick-7-2453401.pdf?src-supplier=Digi-Key; ComponentLink3Description: https://datasheet.ciiva.com/2453/pyu-r-int-thick-7-2453401.pdf?src-supplier=Digi-Key; ComponentLink4URL: https://datasheet.ciiva.com/2453/pyu-r-int-thick-7-2453402.pdf?src-supplier=Digi-Key; ComponentLink4Description: https://datasheet.ciiva.com/2453/pyu-r-int-thick-7-2453402.pdf?src-supplier=Digi-Key; ComponentLink5URL: https://datasheet.ciiva.com/2453/pyu-r-int-thick-7-2453400.pdf?src-supplier=Digi-Key; ComponentLink5Description: https://datasheet.ciiva.com/2453/pyu-r-int-thick-7-2453400.pdf?src-supplier=Digi-Key; ComponentLink6URL: https://datasheet.ciiva.com/12558/pyu-rc0402-51-rohs-l-6-r-8721-12558460.pdf?src-supplier=Mouser; ComponentLink6Description: https://datasheet.ciiva.com/12558/pyu-rc0402-51-rohs-l-6-r-8721-12558460.pdf?src-supplier=Mouser; ComponentLink7URL: https://datasheet.ciiva.com/16744/pyu-rc0402-51-rohs-l-6-r-16744283.pdf?src-supplier=Future+Electronics; ComponentLink7Description: https://datasheet.ciiva.com/16744/pyu-rc0402-51-rohs-l-6-r-16744283.pdf?src-supplier=Future+Electronics; ComponentLink8URL: https://datasheet.ciiva.com/15189/getdatasheetpartid-323636-15189493.pdf?src-supplier=Verical; ComponentLink8Description: https://datasheet.ciiva.com/15189/getdatasheetpartid-323636-15189493.pdf?src-supplier=Verical; Supplier Part Number 1: RC0402FR-075K1L; LCSC Part Number: C105872
R19 = RC0603FR-071ML: RES SMD 1M OHM 1% 1/10W 0603; Manufacturer: Yageo; Voltage Rating: 50V; Resistance: 1MR; Power Rating: 100mW; Temperature Coefficient: 100ppm/°C; Item Type: Resistor; Supplier 1: Digi-Key; Manufacturer Part Number: RC0603FR-071ML; Stock 1: 3824601; Pricing 1: 1=0.1, 10=0.023, 100=0.0094, 1000=0.00421, 2500=0.00366 (USD); Case/Package: 0603; Number of Pins: 2; Case Code (Imperial): 0603; Case Code (Metric): 1608; Min Operating Temperature: -55°C; Max Operating Temperature: 155°C; Voltage Rating (DC): 50V; Tolerance: 1%; Packaging: Tape and Reel; Package Quantity: 5000; Termination: SMD/SMT; Composition: Thick Film; Military Standard: Not; Length: 1.6mm; Height: 0.45mm; Width: 0.8mm; Depth: 0.8mm; REACH SVHC: No SVHC; Lead Free: Lead Free; ComponentLink1URL: http://www.farnell.com/datasheets/2167052.pdf?src-supplier=Mouser; ComponentLink1Description: http://www.farnell.com/datasheets/2167052.pdf?src-supplier=Mouser; ComponentLink2URL: http://www.farnell.com/datasheets/2167052.pdf?src-supplier=Element14; ComponentLink2Description: http://www.farnell.com/datasheets/2167052.pdf?src-supplier=Element14; ComponentLink3URL: http://documents.rs-components.com/techlib://itc_doclist_GB.htm?stockno=5048956&src-supplier=RSComponents; ComponentLink3Description: http://documents.rs-components.com/techlib://itc_doclist_GB.htm?stockno=5048956&src-supplier=RSComponents; Supplier Part Number 1: 311-1.00MHRDKR-ND; LCSC Part Number: C105578